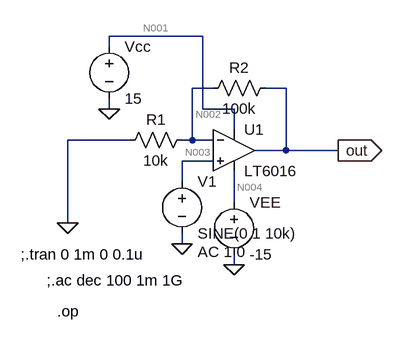
[diagram p0: schematic noninverting_amp.asc]
noninverting_amp.asc, the LTspice schematic file:
Version 4
SHEET 1 880 680
WIRE 144 0 0 0
WIRE 0 16 0 0
WIRE 160 80 128 80
WIRE 272 80 240 80
WIRE 0 112 0 96
WIRE 144 112 144 0
WIRE 192 112 144 112
WIRE 192 144 192 112
WIRE 32 160 -64 160
WIRE 128 160 128 80
WIRE 128 160 112 160
WIRE 160 160 128 160
WIRE 272 176 272 80
WIRE 272 176 224 176
WIRE 352 176 272 176
WIRE 160 192 112 192
WIRE 112 224 112 192
WIRE 192 256 192 208
WIRE -64 288 -64 160
WIRE 112 320 112 304
WIRE 192 352 192 336
FLAG -64 288 0
FLAG 352 176 out
IOPIN 352 176 Out
FLAG 192 352 0
FLAG 0 112 0
FLAG 112 320 0
SYMBOL OpAmps\\LT6016 192 176 R0
SYMATTR InstName U1
SYMBOL res 128 144 R90
WINDOW 0 0 56 VBottom 2
WINDOW 3 32 56 VTop 2
SYMATTR InstName R1
SYMATTR Value 10k
SYMBOL res 256 64 R90
WINDOW 0 0 56 VBottom 2
WINDOW 3 32 56 VTop 2
SYMATTR InstName R2
SYMATTR Value 100k
SYMBOL voltage 0 0 R0
WINDOW 123 0 0 Left 0
WINDOW 39 0 0 Left 0
SYMATTR InstName Vcc
SYMATTR Value 15
SYMBOL voltage 192 240 R0
WINDOW 123 0 0 Left 0
WINDOW 39 0 0 Left 0
SYMATTR InstName VEE
SYMATTR Value -15
SYMBOL voltage 112 208 R0
WINDOW 123 24 124 Left 2
WINDOW 39 0 0 Left 0
SYMATTR InstName V1
SYMATTR Value SINE(0 1 10k)
SYMATTR Value2 AC 1 0
TEXT -96 376 Left 2 !;.ac dec 100 1m 1G
TEXT -136 336 Left 2 !;.tran 0 1m 0 0.1u
TEXT -80 424 Left 2 !.op

The netlist it stands for:
* noninverting_amp.asc
* U1: LT6016 (symbol OpAmps\LT6016 not available, pins judged from their places): In+=N003 In-=N002 V+=N001 V-=N004 OUT=out
R1 N002 0 10k
R2 out N002 100k
Vcc N001 0 15
VEE N004 0 -15
V1 N003 0 SINE(0 1 10k) AC 1 0
;.ac dec 100 1m 1G
;.tran 0 1m 0 0.1u
.op
.backanno
.end

* Results of the author's LTspice run, read from the files saved beside the schematic
* Operating Point, zero values left out:
*   V(n004) = -15 V
*   V(n001) = 15 V
*   V(out) = 176.5 µV
*   V(n002) = -20.2 nV
*   I(R2) = 1.765 nA
*   I(R1) = -2.02 pA
*   I(V1) = -1.767 nA
*   I(Vee) = 345.9 µA
*   I(Vcc) = -345.9 µA
*   Ix(u1:1) = 1.767 nA
*   Ix(u1:2) = 1.767 nA
*   Ix(u1:3) = 345.9 µA
*   Ix(u1:4) = -345.9 µA
*   Ix(u1:5) = -1.751 nA
* Operating Point:
*   V(n004) = -15 V
*   V(n001) = 15 V
*   V(out) = 176.5 µV
*   V(n003) = 0 V
*   V(n002) = -20.2 nV
*   I(R2) = 1.765 nA
*   I(R1) = -2.02 pA
*   I(V1) = -1.767 nA
*   I(Vee) = 345.9 µA
*   I(Vcc) = -345.9 µA
*   Ix(u1:1) = 1.767 nA
*   Ix(u1:2) = 1.767 nA
*   Ix(u1:3) = 345.9 µA
*   Ix(u1:4) = -345.9 µA
*   Ix(u1:5) = -1.751 nA
* From the log:
*   Semiconductor Device Operating Points:
*                           --- Diodes ---
*   Name:    d:u1:15     d:u1:14     d:u1:17     d:u1:16     d:u1:13
*   Model: u1:dbiasott u1:dbiasott  u1:dnlin    u1:d1meg   u1:dbiasdrop
*   Id:     -1.32e-08   -1.32e-08    9.21e-10   -2.02e-14    2.80e-05
*   Vd:     -1.32e+01   -1.32e+01    1.51e-03   -2.02e-08    1.77e+00
*   Req:     1.00e-09    1.00e-09    1.25e-06    1.00e-06    1.00e-03
*   CAP:     0.00e+00    0.00e+00    0.00e+00    0.00e+00    0.00e+00
*   Name:    d:u1:12     d:u1:7      d:u1:11     d:u1:10     d:u1:8
*   Model:    u1:dp     u1:dlimpr    u1:dnr      u1:desd     u1:desd
*   Id:      3.20e-05   -8.38e-10    2.86e-04   -1.50e-08   -1.50e-08
*   Vd:      3.00e+01   -8.38e-01    4.24e-02   -1.50e+01   -1.50e+01
*   Req:     1.00e-03    1.00e-09    1.00e-01    1.00e-09    1.00e-09
*   CAP:     0.00e+00    0.00e+00    0.00e+00    0.00e+00    0.00e+00
*   Name:    d:u1:1      d:u1:2      d:u1:4      d:u1:3      d:u1:9
*   Model:   u1:desd    u1:dlim0    u1:dlimp     u1:dsbd     u1:dlim
*   Id:     -1.50e-08   -1.51e-10    3.64e-09    2.86e-04    3.78e-08
*   Vd:     -1.50e+01   -1.51e-03    3.64e-01    4.74e-01    3.03e-01
*   Req:     1.00e-09    1.00e-07    1.00e-08    1.00e-02    1.25e-07
*   CAP:     0.00e+00    0.00e+00    0.00e+00    0.00e+00    0.00e+00
*   Name:    d:u1:6      d:u1:5
*   Model:  u1:dlimn2   u1:dlimn1
*   Id:      4.14e-08    9.42e-10
*   Vd:      3.91e-01    3.91e-01
*   Req:     2.00e-07    2.41e-09
*   CAP:     0.00e+00    0.00e+00
*                           --- VDMOSFET Transistors ---
*   Name:        m:u1:2      m:u1:1
*   Model:        u1:pi       u1:ni
*   Id:         -2.86e-04    2.84e-04
*   Vgs:        -3.64e-01    3.91e-01
*   Vds:        -1.45e+01    1.50e+01
*   Vth:        -3.00e-01    3.00e-01
*   Gm:          8.86e-03    6.26e-03
*   Gds:         2.50e-06    2.47e-06
*   Cgs:         0.00e+00    0.00e+00
*   Cgd:         0.00e+00    0.00e+00
*   Cbody:       0.00e+00    0.00e+00